# EAGLE design Termocouple (EAGLE 9.3.0)
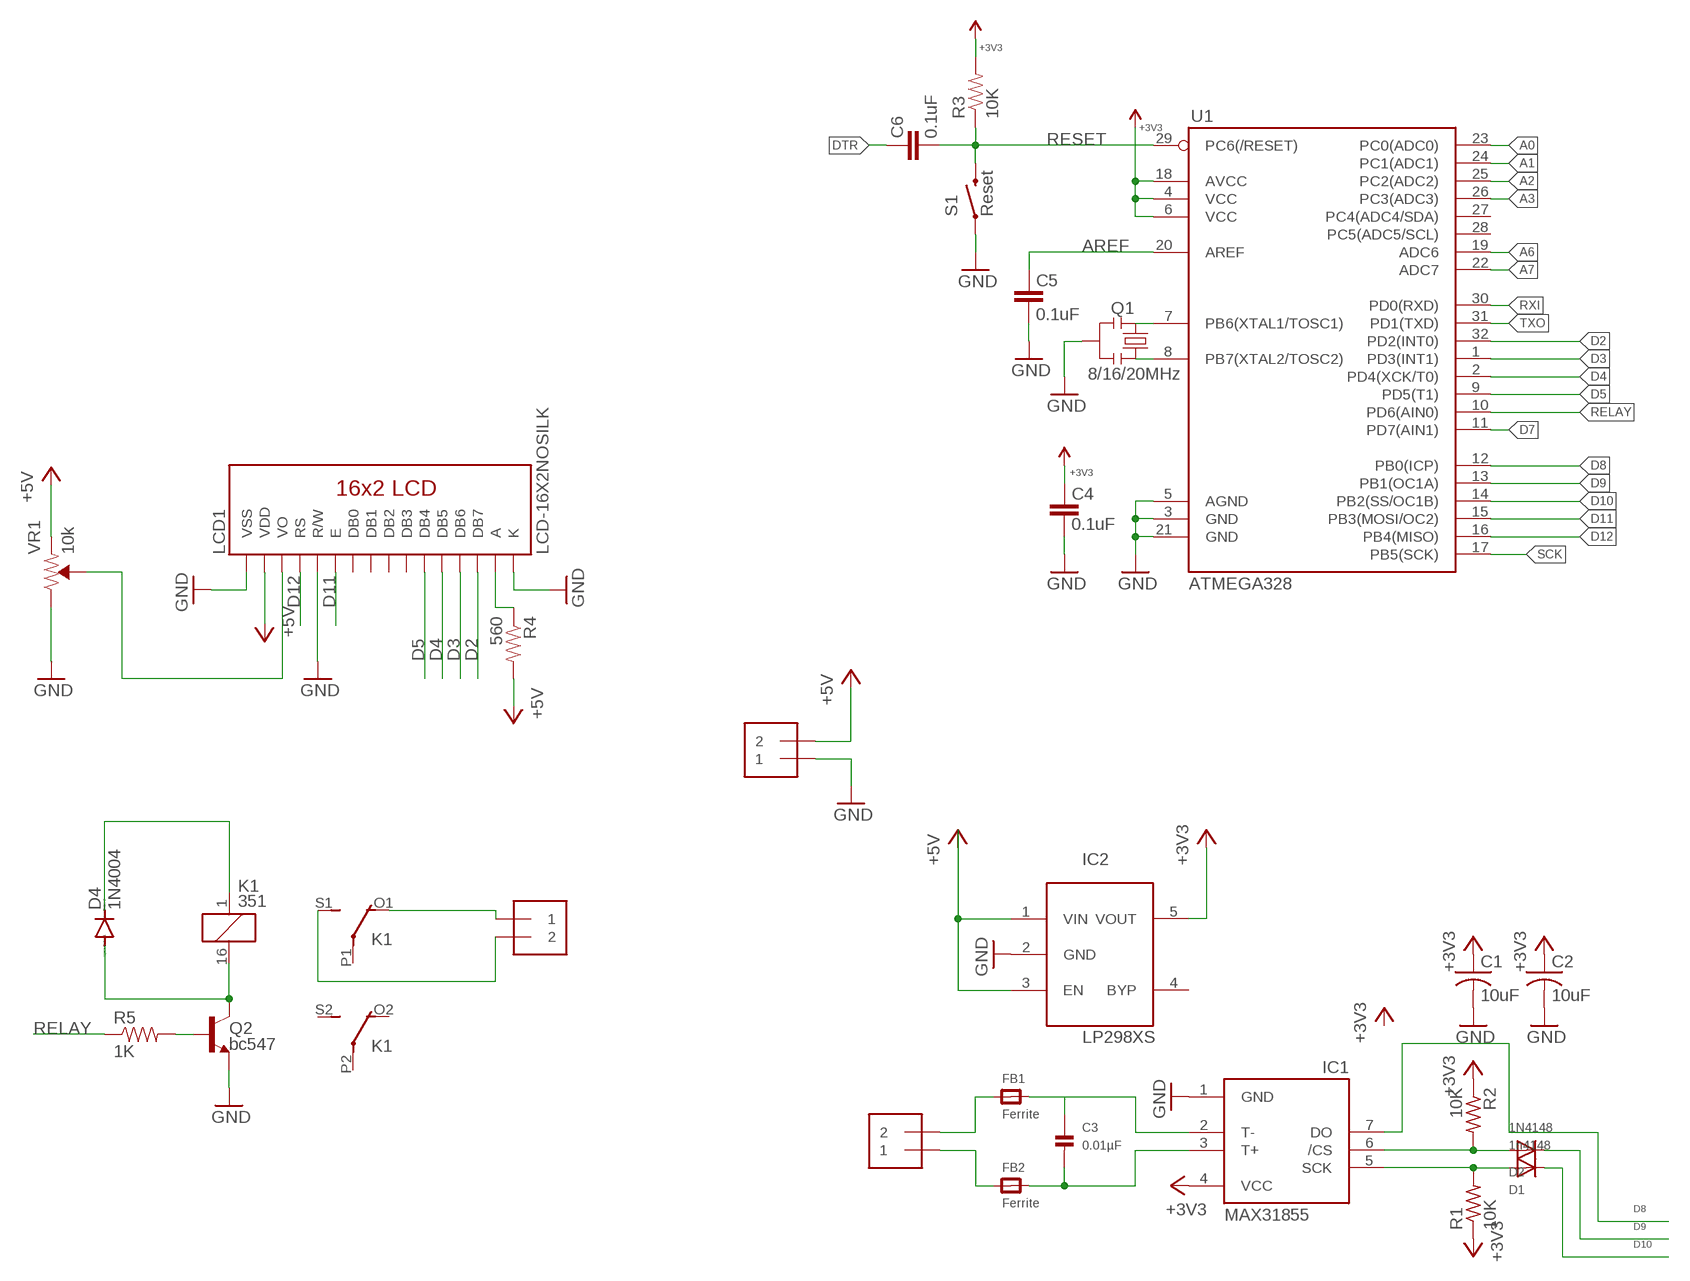
[diagram p0: schematic, sheet 1]

## Parts
C1  10uF  C-USC0805K  [C0805K]
C2  10uF  C-USC0805K  [C0805K]
C3  0.01µF  CAP_CERAMIC_0805  [_0805]
C4  0.1uF  CAP0603-CAP  [0603-CAP]
C5  0.1uF  CAP0603-CAP  [0603-CAP]
C6  0.1uF  CAP0603-CAP  [0603-CAP]
D1  1n4148  DIODESOD-323F  [SOD-323F]
D2  1N4148  DIODESOD-323F  [SOD-323F]
D4  1N4004  [DO41-10]
FB1  Ferrite  FERRITE_0805  [_0805]
FB2  Ferrite  FERRITE_0805  [_0805]
IC1  MAX31855  MAX6675  [SO08]
IC2  LP298XS  [SOT23-5L]
J1  1X2-3.5MM  [1X2-3.5MM]
J2  1X2-3.5MM  [1X2-3.5MM]
J3  1X2-3.5MM  [1X2-3.5MM]
K1  351  [351]
LCD1  LCD-16X2NOSILK  [LCD-16X2_NOSILK]
Q1  8/16/20MHz  RESONATOR1:1  [RESONATOR-SMD-1:1]
Q2  bc547  TRANS_NPN-MMBT2222AL  [SOT23-3]
R1  10K  R-US_R0805  [R0805]
R2  10K  R-US_R0805  [R0805]
R3  10K  RESISTOR0805-RES  [0805]
R4  560  RESISTOR0805-RES  [0805]
R5  1K  RESISTOR0805-RES  [0805]
S1  Reset  SWITCH-MOMENTARY-2SMD-ALT01  [TACTILE-SWITCH-SMD-ALT01]
U1  ATMEGA328  ATMEGA168  [TQFP32-08]
VR1  10k  TRIMPOT-SMD-3MM-CLOSED-1/8W-20%  [TRIMPOT-SMD-3MM-CLOSED]

## Nets
+3V3: C1.1 C2.1 C4.2 IC1.4(VCC) IC2.5(VOUT) R1.1 R2.1 R3.2 U1.4(VCC) U1.6(VCC) U1.18(AVCC) ; supply symbol labelled VCC
+5V: IC2.1(VIN) IC2.3(EN) J2.2 LCD1.2(VDD) R4.2 VR1.1(CCW)
A0: U1.23(PC0(ADC0))
A1: U1.24(PC1(ADC1))
A2: U1.25(PC2(ADC2))
A3: U1.26(PC3(ADC3))
A6: U1.19(ADC6)
A7: U1.22(ADC7)
AREF: C5.2 U1.20(AREF)
CS: D2.A IC1.6(/CS) R2.2
D2: LCD1.14(DB7) U1.32(PD2(INT0))
D3: LCD1.13(DB6) U1.1(PD3(INT1))
D4: LCD1.12(DB5) U1.2(PD4(XCK/T0))
D5: LCD1.11(DB4) U1.9(PD5(T1))
D7: U1.11(PD7(AIN1))
D8: IC1.7(DO) U1.12(PB0(ICP))
D9: D2.C U1.13(PB1(OC1A))
D10: D1.C U1.14(PB2(SS/OC1B))
D11: LCD1.6(E) U1.15(PB3(MOSI/OC2))
D12: LCD1.4(RS) U1.16(PB4(MISO))
DTR: C6.2
GND: C1.2 C2.2 C4.1 C5.1 IC1.1(GND) IC2.2(GND) J2.1 LCD1.1(VSS) LCD1.5(R/W) LCD1.16(K) Q1.2 Q2.2(E) S1.1 S1.2 U1.3(GND) U1.5(AGND) U1.21(GND) VR1.3(CW)
N$1: FB1.1 J1.2
N$2: LCD1.15(A) R4.1
N$3: LCD1.3(VO) VR1.2(WIPER)
N$4: C3.1 FB1.2 IC1.2(T-)
N$5: FB2.1 J1.1
N$6: C3.2 FB2.2 IC1.3(T+)
N$8: Q1.3 U1.8(PB7(XTAL2/TOSC2))
N$9: Q1.1 U1.7(PB6(XTAL1/TOSC1))
N$10: D4.C K1.1
N$11: D4.A K1.16 Q2.3(C)
N$12: Q2.1(B) R5.2
N$13: J3.2 K1.S1(2:S)
N$14: J3.1 K1.O1(2:O)
RELAY: R5.1 U1.10(PD6(AIN0))
RESET: C6.1 R3.1 S1.3 S1.4 U1.29(PC6(/RESET))
RXI: U1.30(PD0(RXD))
SCK: D1.A IC1.5(SCK) R1.2 U1.17(PB5(SCK))
TXO: U1.31(PD1(TXD))
Unconnected: IC2.4(BYP) K1.O2(3:O) K1.P1(2:P) K1.P2(3:P) K1.S2(3:S) LCD1.7(DB0) LCD1.8(DB1) LCD1.9(DB2) LCD1.10(DB3) U1.27(PC4(ADC4/SDA)) U1.28(PC5(ADC5/SCL))

## Library data of the parts
C1 C2 = adafruit:C-US: CAPACITOR, American symbol
C3 = microbuilder:CAP_CERAMIC: Ceramic Capacitors 0402 - 0402 Surface Mount Capacitors 16pF 50V 5% [Digikey: 445-4899-2-ND] 18pF 50V 5% [Digikey: 490-1281-2-ND] 22pF 50V 5% [Digikey: 490-1283-2-ND] 68pF 50V 5% [Digikey: 490-1289-2-ND] 0.1uF 10V 10% [Digikey: 490-1318-2-ND] 1.0uF 6.3V 10% [Digikey: 490-1320-2-ND] 0603 - 0603 Surface Mount Capacitors 16 pF 50V 5% [Digikey: 445-5051-2-ND] 22 pF 50V [Digikey: PCC220ACVTR-ND] 33 pF 50V 5% [Digikey: 490-1415-1-ND] 56pF 50V 5% [Digikey: 490-1421-1-ND] 220pF 50V 5% [Digikey: 445-1285-1-ND] 680 pF 50V 2200 pF 50V 5% C0G [Digikey: 445-1297-1-ND] 5600 pF 100V 5% X7R [Digikey: 478-3711-1-ND] 0.1 µF 25V 10% [Digikey: PCC2277TR-ND] 0.22 µF 16V 10% X7R [Digikey: 445-1318-1-ND] 1.0 µF 25V 10% [Digikey: 445-5146-2-ND] 0603 - RF Specific 3pF 250V +/-0.1pF RF [Digikey: 712-1347-1-ND] 18 pF 250V 5% [Digikey: 478-3505-1-ND or 712-1322-1-ND] 56 pF 250V 5% C0G RF [Digikey: 490-4867-1-ND] 68 pF 250V RF [Digikey: 490-4868-1-ND] 0805 - 0805 Surface Mount Capacitors 220 pF 250V 2% RF Ceramic Capacitor [Digikey: 712-1398-1-ND] 1000 pF 50V 2% NP0 Ceramic Capacitor [Digikey: 478-3760-1-ND] 0.1 µF 25V 10% Ceramic Capacitor [Digikey: PCC1828TR-ND] 1.0 µF 16V 10% Ceramic Capacitor[Digikey: 490-1691-2-ND] 10.0 µF 10V 10% Ceramic Capacitor[Digikey: 709-1228-1-ND] 10.0 uF 16V 10% Ceramic Capacitor [Digikey: 478-5165-2-ND] 47 uF 6.3V 20% Ceramic Capacitor [Digikey: 587-1779-1-ND or 399-5506-1-ND] 1206 - 1206 Surface Mount Capacitors 47uF 10V 20% Ceramic Capacitor [Digikey: 490-5528-1-ND or 399-5508-1-ND or 445-6010-1-ND] 100uF 6.3V -20%, +80% Y5V Ceramic Capacitor (Digikey: 490-4512-1-ND, Mouser: 81-GRM31CF50J107ZE1L)
C4-C6 = SparkFun:CAP: Capacitor Standard 0603 ceramic capacitor, and 0.1" leaded capacitor.
D1 D2 = adafruit:DIODE: Diode SMADIODE - SMA Surface Mount Package 20V 1A Schottky Diode Digikey: 641-1014-6-ND DO-1N4148 - Through Hole Small Current Diode SOD-123 20V 1 A (.5mV Vf) Schottky Diode - Digikey: MBRX120TPMSCT-ND SOD-323 10V 570mA (.38mV Vf, 3ns) Schottky Diode - Digikey: ZLLS410CT-ND SOD-523 30V 30mA Schottky Diode (RB751S-40TE61) - Digikey: RB751S-40TE61CT-ND SOT23-R/W - SOT23 Package (R = Solder Paste/Reflow Ovens, W = Hand-Soldering) BAT54Film 40V 300mA - Digikey: 497-7162-1-ND
D4 = diode:1N4004: DIODE general purpose rectifier, 1 A
FB1 FB2 = microbuilder:FERRITE: Ferrite Bead 0603 MMZ1608B121C - 120 Ohm @ 100MHz, 600mA, 0.15 Ohm DC Resistance - Digikey: 445-2164-1-ND BK1608HW121-T - 120 Ohm, 600mA Ferrite Chip - Digikey: 587-1876-2-ND 0805 HZ0805B272R-10 - 2.7K Ohm @ 100MHz, 200mA, 0.8 Ohm DC Resistance - Digikey: 240-2504-1-ND (see also Murata BLM21BD272SN1L) MMZ2012Y152B - 1.5K Ohm @ 100MHz, 500mA, 0.4 Ohm DC Resistance - Digikey: 445-1560-1-ND - Mainly for high frequency (80-400MHz) MMZ2012R102A - 1K Ohm @ 100MHz, 500mA, 0.3 Ohm DC Resistance - Digikey: 445-1555-2-ND - More general purpose (10-200MHz)
IC1 = adafruit:MAX6675
IC2 = adafruit:LP298X
J1-J3 = adafruit:1X2: 3.5mm Terminal block http://www.ladyada.net/library/pcb/eaglelibrary.html
K1 = relay:351: RELAY 2 x switch, Omron; OC_FARNELL: unknown; OC_NEWARK: unknown
LCD1 = SparkFun-Displays:LCD-16X2: Standard text-only 16x2 parallel input LCD Basic 16 character by 2 line display. Typically utilizes the extremely common HD44780 parallel interface chipset SparkFun Products: Basic 16x2 Green <https://www.sparkfun.com/products/255> Basic 8x2 Green <https://www.sparkfun.com/products/11122>; SF_ID: LCD-00255
Q1 = Testing:RESONATOR: Resonator Small SMD resonator. This is the itty bitty 10/20MHz resonators with built in caps. CSTCE10M0G55 and CSTCE20M0V53. Footprint for SMD has been used in SFE production for years, and does work okay. 1:1 is an attempt to get larger fillets on the sides so it will be easier to inspect these solders in our AOI machine. The pads have been minimized to match the actual metal under the resonator. To see this relation, it includes an image import of the bottom side of the component. Imported to scale on layer 200.
Q2 = SparkFun-DiscreteSemi:TRANS_NPN: NPN transistor Current controlled devices typically used to amplify current or used as a switch. BC547 - COM-08928 <http://www.sparkfun.com/products/8928> (TO-92 45V 100mA) (1.Collector 2.Base 3.Emitter) 2N3904 - COM-00521 <http://www.sparkfun.com/products/521> (TO-92 40V 200mA) (1.Emitter 2.Base 3.Collector) P2N2222A - COM-12852 <http://www.sparkfun.com/products/12852> (TO-92 40V 600mA) (1.Collector 2.Base 3.Emitter); PROD_ID: TRANS-08049; VALUE: 600mA/40V
R1 R2 = adafruit:R-US_: RESISTOR, American symbol
R3-R5 = SparkFun:RESISTOR: Resistor Basic schematic elements and footprints for 0603, 1206, and PTH resistors.
S1 = Testing:SWITCH-MOMENTARY-2: Various NO switches- pushbuttons, reed, etc
U1 = SparkFun:ATMEGA168
VR1 = SparkFun-Resistors:TRIMPOT: Trimming Potentiometer (Trimpot) Three-terminal potentiometers, with an adjustable wiper and two adjustable resistors. A pot can be used to create a configurable voltage divider, or as a variable resistor. "Trimpots" are a subset of potentiometers, usually intended for "set-and-forget" applications. They're often more delicate than standard potentiometers - rated for fewer turns. Variants PTH-KNOB - PTH Trimpot w/ finger-adjustable knob Trimpot 10K with Knob <https://www.sparkfun.com/products/9806> (COM-09806) Datasheet <http://www.sparkfun.com/datasheets/Components/General/TSR-3386.pdf> SMD-3MM-CLOSED-FRAME - SMD 3mm Square Closed-Frame Trimpot Used on e.g. EasyDriver - Stepper Motor Driver <https://www.sparkfun.com/products/12779> Datasheet <http://www.bitechnologies.com/pdfs/22.pdf> (22AR10KTR) SMD-5MM - SMD 5mm Square Closed-Frame Trimpot Used on e.g. IOIO-OTG - V2.2 <https://www.sparkfun.com/products/13613> Datasheet <http://www.vishay.com/docs/51008/ts53.pdf> (TS53YL502MR10) SMD-3MM-1/10W-25% - 3mm Square Open-Frame Trimpot Used on e.g. SparkFun Shapeoko <https://www.sparkfun.com/products/13899> Datasheet <http://www.bourns.com/docs/Product-Datasheets/TC33.pdf> (TC33X-2-103E); PROD_ID: RES-09285

## Net classes
1 vcc: width 0.254 mm

## Board
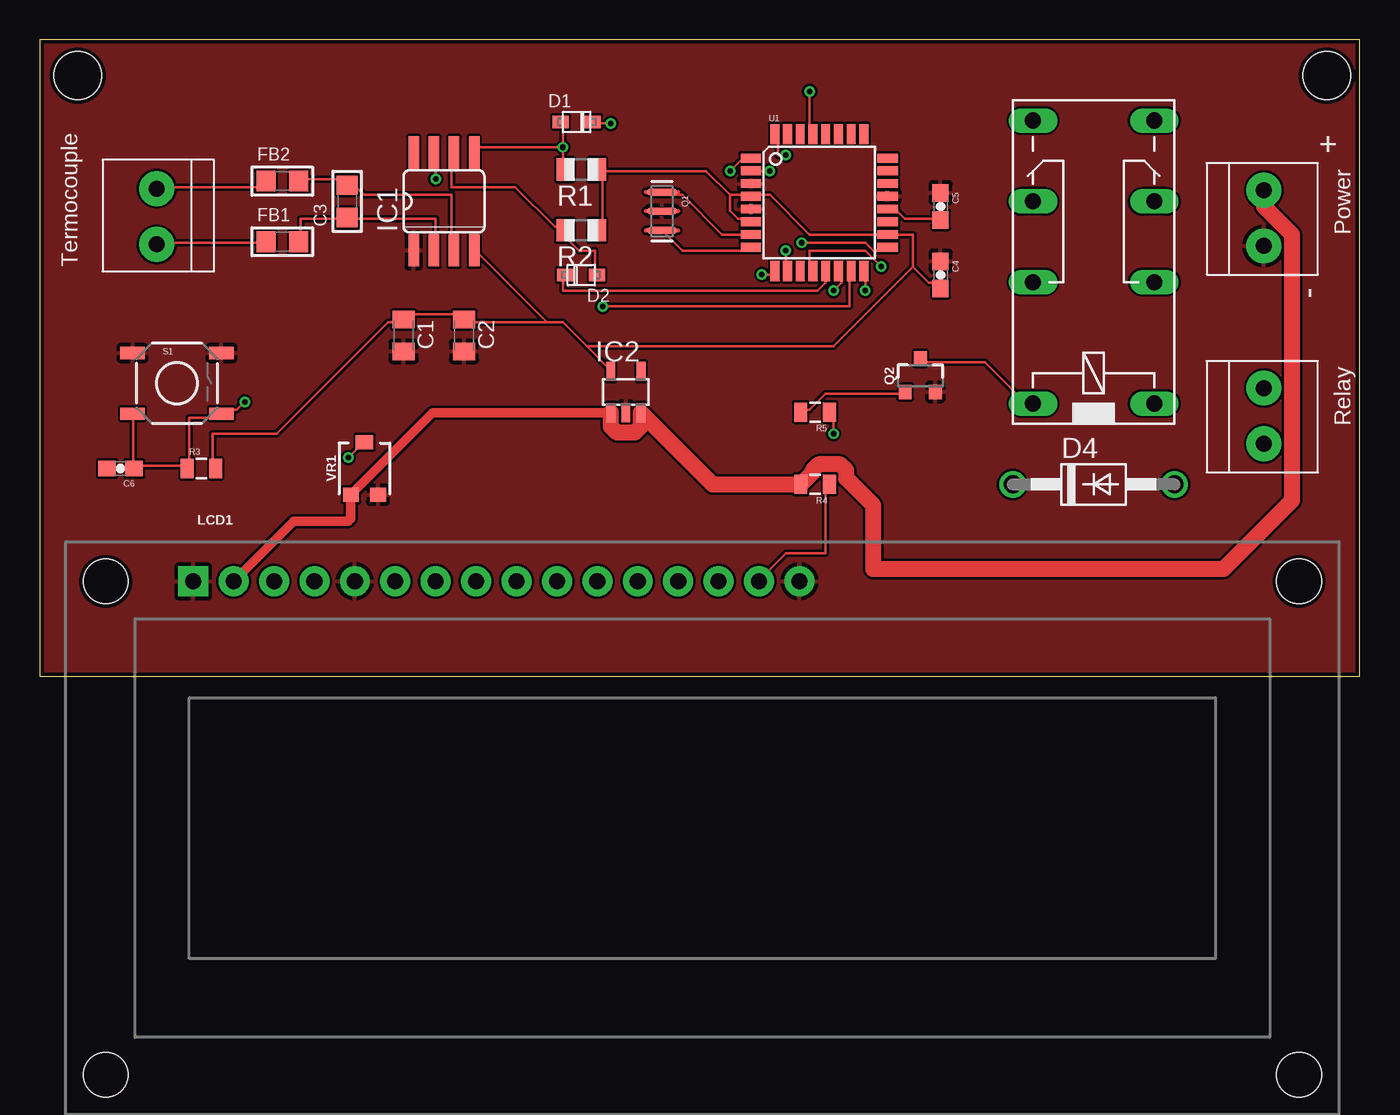
[diagram p1: board, top side]
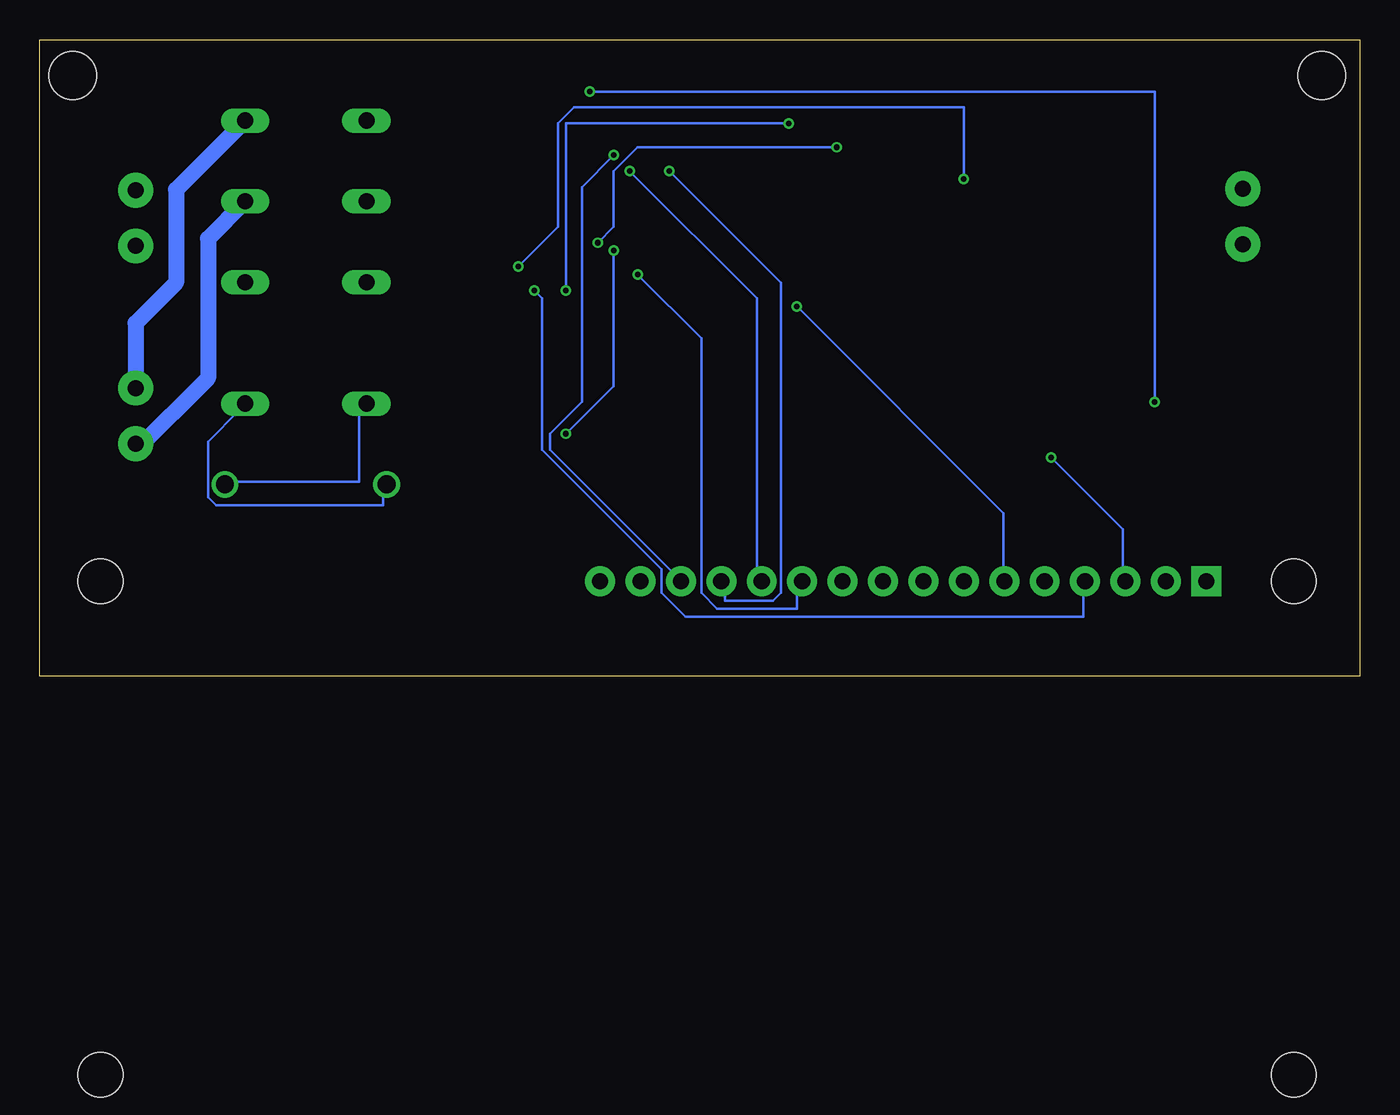
[diagram p2: board, bottom side, seen from below]

Size 82.95 x 39.98 mm. Coordinates in mm from the lower left corner, seen from the top.
Outline: 0,0 82.95,0 82.95,39.98 0,39.98 0,0
Copper layers (1*16): Top 0.035mm / dielectric 1.5mm / Bottom 0.035mm
Design rules "SeeedStudio_2layer_DRU_no_angle_20140221": minimum track width 6mil, minimum drill 12mil, track to track 6mil, track to pad 6mil, pad to pad 6mil, via to via 6mil, smd to smd 0mil, copper to edge 10mil, drill to drill 10mil, minimum pad ring 10mil, minimum via ring 6mil, stop-mask expansion 2mil, vias tented up to drill 100mil, thermal gap 10mil
Holes 3 mm at 2.38,37.73 80.88,37.73

### Footprints (pad centres in the part's own frame; a part is rotated, then mirrored left to right if it is on the bottom)
C0805K = smd 1.1 x 1.4: 1 -1,0; 2 1,0
_0805 = smd 1.2 x 1.3: 1 -1.016,0; 2 1.016,0
0603-CAP = smd 1.1 x 1: 1 -0.85,0; 2 0.85,0
SOD-323F = smd 1 x 0.8: A -1,0; C 1,0
DO41-10 = drill 1.118: A 5.08,0; C -5.08,0
SO08 = smd 0.66 x 2.032: 1 -1.905,-3.073; 2 -0.635,-3.073; 3 0.635,-3.073; 4 1.905,-3.073; 5 1.905,3.073; 6 0.635,3.073; 7 -0.635,3.073; 8 -1.905,3.073
SOT23-5L = smd 0.55 x 1.2: 1 -0.95,-1.3; 2 0,-1.3; 3 0.95,-1.3; 4 0.95,1.3; 5 -0.95,1.3
1X2-3.5MM = drill 1 pad 2.184: 1 1.8,0; 2 -1.7,0
351 = drill 1.016 long: 1 -3.81,-3.81; 16 -3.81,3.81; O1 8.89,-3.81; O2 8.89,3.81; P1 3.81,-3.81; P2 3.81,3.81; S1 13.97,-3.81; S2 13.97,3.81
LCD-16X2_NOSILK = drill 1.016 pad 1.88 square: 1 -32,15.5 | drill 1.016 pad 1.88: 2 -29.46,15.5; 3 -26.92,15.5; 4 -24.38,15.5; 5 -21.84,15.5; 6 -19.3,15.5; 7 -16.76,15.5; 8 -14.22,15.5; 9 -11.68,15.5; 10 -9.14,15.5; 11 -6.6,15.5; 12 -4.06,15.5; 13 -1.52,15.5; 14 1.02,15.5; 15 3.56,15.5; 16 6.1,15.5 | hole 2.8: -37.5,15.5; -37.5,-15.5; 37.5,15.5; 37.5,-15.5
RESONATOR-SMD-1:1 = smd 0.45 x 1.905: 1 -1.2,0; 2 0,0; 3 1.2,0
SOT23-3 = smd 0.8 x 0.9: 1 -0.95,-1; 2 0.95,-1; 3 0,1.1
R0805 = smd 1.1 x 1.4: 1 -1,0; 2 1,0
0805 = smd 0.8 x 1.2: 1 -0.9,0; 2 0.9,0
TACTILE-SWITCH-SMD-ALT01 = smd 1.524 x 0.762: 1 -2.794,1.905; 2 2.794,1.905; 3 -2.794,-1.905; 4 2.794,-1.905
TQFP32-08 = smd 1.27 x 0.559: 1 -4.293,2.8; 2 -4.293,2; 3 -4.293,1.2; 4 -4.293,0.4; 5 -4.293,-0.4; 6 -4.293,-1.2; 7 -4.293,-2; 8 -4.293,-2.8; 17 4.293,-2.8; 18 4.293,-2; 19 4.293,-1.2; 20 4.293,-0.4; 21 4.293,0.4; 22 4.293,1.2; 23 4.293,2; 24 4.293,2.8 | smd 0.559 x 1.27: 9 -2.8,-4.293; 10 -2,-4.293; 11 -1.2,-4.293; 12 -0.4,-4.293; 13 0.4,-4.293; 14 1.2,-4.293; 15 2,-4.293; 16 2.8,-4.293; 25 2.8,4.293; 26 2,4.293; 27 1.2,4.293; 28 0.4,4.293; 29 -0.4,4.293; 30 -1.2,4.293; 31 -2,4.293; 32 -2.8,4.293
TRIMPOT-SMD-3MM-CLOSED = smd 1 x 0.9: 1 -0.85,-1.65; 3 0.85,-1.65 | smd 1.1 x 0.9: 2 0,1.65

### Placement (x,y rotation side)
C1  22.86,21.4 270 top
C2  26.67,21.4 270 top
C3  19.32,29.83 90 top
C4  56.61,25.21 270 top
C5  56.61,29.52 270 top
C6  5.08,13.05 180 top
D1  33.74,34.82 0 top
D2  34.02,25.21 180 top
D4  66.23,12.05 0 top
FB1  15.24,27.29 0 top
FB2  15.24,31.1 0 top
IC1  25.4,29.83 0 top
IC2  36.83,17.86 0 top
J1  7.35,28.83 90 top
J2  76.93,28.83 270 top
J3  76.93,16.4 270 top
K1  66.23,20.94 90 top
LCD1  41.64,-9.54 0 top
Q1  39.1,29.21 270 top
Q2  55.34,18.86 0 top
R1  34.02,31.83 180 top
R2  34.02,28.02 180 top
R3  10.16,13.05 0 top
R4  48.72,12.05 180 top
R5  48.72,16.59 180 top
S1  8.62,18.4 0 top
U1  48.99,29.75 0 top
VR1  20.4,13.05 0 top

### Tracks (layer width: path | path; a pad name or v marks a point on that pad's centre or on a via)
+3V3
  Top 0.152: 54.88,25.73 55.88,24.73 56.38,24.73 C4.2 | 54.88,25.73 54.88,27.73 53.38,27.73 U1.18 52.88,27.73 48.38,27.73 45.88,30.23 44.88,30.23 U1.4 44.38,30.23 43.38,30.23 | 43.38,30.23 43.38,29.23 43.88,28.73 44.38,28.73 U1.6 | 35.38,31.73 35.38,28.23 R2.1 | 43.38,30.23 41.88,31.73 35.38,31.73 | 35.38,31.73 R1.1 | 34.38,20.73 32.88,22.23 31.88,22.23 | 34.38,20.73 35.88,19.23 IC2.5 | 31.88,22.23 26.88,22.23 C2.1 26.38,22.73 22.88,22.73 C1.1 22.38,22.23 21.88,22.23 14.88,15.23 10.88,15.23 10.88,13.23 R3.2 | 31.88,22.23 27.38,26.73 IC1.4 | 54.88,25.73 49.88,20.73 34.38,20.73
+5V
  Top 0.61: LCD1.2 15.95,9.73 19.38,9.73 19.55,9.9 VR1.1 24.7,16.55 35.9,16.55
  Top 1.016: J2.2 76.93,29.51 78.68,27.76 78.68,11.03 74.38,6.73 52.38,6.73 52.38,10.73 50.68,12.43 50.68,12.92 50.29,13.31 48.95,13.31 48.56,12.92 48.56,12.79 R4.2 42.29,12.05 IC2.3 37.77,16.55 37.77,15.69 37.38,15.3 36.28,15.3 35.9,15.69 35.9,16.55 IC2.1
AREF
  Top 0.152: C5.2 56.38,28.73 54.38,28.73 53.88,29.23 53.38,29.23 U1.20
CS
  Top 0.152: D2.A 34.88,25.23 34.88,26.73 33.88,26.73 32.88,27.73 R2.2 32.88,28.23 32.38,28.23 29.88,30.73 25.88,30.73 25.88,32.73 IC1.6
D2  (via drill 0.35)
  Top 0.152: v46.88,32.73 46.38,32.73 46.38,33.73 U1.32
  Bottom 0.152: v46.88,32.73 48.88,30.73 48.88,17.23 50.88,15.23 50.88,14.23 42.88,6.23 LCD1.14
D3  (via drill 0.35)
  Top 0.152: v43.38,31.73 44.38,32.73 U1.1
  Bottom 0.152: v43.38,31.73 36.38,24.73 36.38,5.23 36.88,4.73 39.88,4.73 39.88,5.73 LCD1.13
D4  (via drill 0.35)
  Top 0.152: v45.88,31.73 44.88,31.73 U1.2
  Bottom 0.152: v45.88,31.73 37.88,23.73 37.88,6.23 LCD1.12
D5  (via drill 0.35)
  Top 0.152: v45.38,25.23 46.38,25.23 U1.9
  Bottom 0.152: v45.38,25.23 41.38,21.23 41.38,5.23 40.38,4.23 35.38,4.23 35.38,5.73 LCD1.11
D8  (via drill 0.35)
  Top 0.152: v52.88,25.73 51.88,26.73 48.38,26.73 48.38,25.73 U1.12 | v24.88,31.23 24.88,32.73 IC1.7
  Bottom 0.152: v52.88,25.73 50.38,28.23 50.38,34.73 49.38,35.73 24.88,35.73 v24.88,31.23
D9
  Top 0.152: D2.C 32.88,25.23 32.88,24.23 48.88,24.23 49.38,24.73 49.38,25.23 U1.13
D10  (via drill 0.35)
  Top 0.152: v35.88,34.73 34.88,34.73 D1.C | v49.88,24.23 50.38,24.73 50.38,25.23 U1.14
  Bottom 0.152: v35.88,34.73 49.88,34.73 v49.88,24.23
D11  (via drill 0.35)
  Top 0.152: v35.38,23.23 50.88,23.23 50.88,25.23 U1.15
  Bottom 0.152: v35.38,23.23 22.38,10.23 22.38,6.23 LCD1.6
D12  (via drill 0.35)
  Top 0.152: v51.88,24.23 51.88,25.23 U1.16
  Bottom 0.152: v51.88,24.23 51.38,23.73 51.38,14.23 43.88,6.73 43.88,5.23 42.38,3.73 17.38,3.73 17.38,5.73 LCD1.4
GND
  pour Top: -0.62,40.73 84.38,40.73 84.38,-1.27 -0.62,-1.27
N$1
  Top 0.152: FB1.1 13.88,27.23 7.38,27.23 J1.2
N$2
  Top 0.152: R4.1 49.38,11.73 49.38,7.73 46.88,7.73 45.38,6.23 LCD1.15
N$3  (via drill 0.35)
  Top 0.152: v19.38,13.73 20.38,14.73 VR1.2
  Bottom 0.152: v19.38,13.73 14.88,9.23 14.88,6.23 LCD1.3
N$4
  Top 0.152: FB1.2 16.38,27.73 16.38,28.73 18.88,28.73 C3.1 19.38,28.73 24.88,28.73 24.88,27.23 IC1.2
N$5
  Top 0.152: FB2.1 13.88,30.73 7.38,30.73 J1.1
N$6
  Top 0.152: FB2.2 16.38,31.23 18.88,31.23 C3.2 19.38,30.73 19.88,30.73 20.38,30.23 25.88,30.23 25.88,27.23 IC1.3
N$8
  Top 0.152: Q1.3 40.38,26.73 44.38,26.73 U1.8
N$9
  Top 0.152: U1.7 44.38,27.73 42.88,27.73 40.38,30.23 39.38,30.23 Q1.1
N$10
  Bottom 0.152: K1.1 70.38,16.73 72.38,14.73 72.38,11.23 71.88,10.73 61.38,10.73 61.38,11.73 D4.C
N$11
  Top 0.152: Q2.3 55.38,19.73 59.38,19.73 61.88,17.23 62.38,17.23 K1.16
  Bottom 0.152: D4.A 70.88,12.23 62.88,12.23 62.88,16.73 K1.16
N$12
  Top 0.152: Q2.1 54.38,17.73 49.38,17.73 48.38,16.73 47.88,16.73 R5.2
N$13
  Bottom 1.016: K1.S1 74.38,30.57 74.38,24.73 76.93,22.18 J3.2
N$14
  Bottom 1.016: K1.O1 72.38,27.49 72.38,18.73 76.93,14.18 J3.1
RELAY  (via drill 0.35)
  Top 0.152: v49.88,15.23 49.88,16.23 R5.1 | v46.88,26.73 46.88,25.73 U1.10
  Bottom 0.152: v49.88,15.23 46.88,18.23 v46.88,26.73
RESET  (via drill 0.35)
  Top 0.152: S1.3 5.88,16.23 5.88,13.23 C6.1 6.38,13.23 8.88,13.23 R3.1 9.38,13.23 9.38,16.23 11.38,16.23 S1.4 11.88,16.73 12.38,16.73 v12.88,17.23 | v48.38,36.73 48.38,34.23 U1.29
  Bottom 0.152: v48.38,36.73 12.88,36.73 v12.88,17.23
SCK  (via drill 0.35)
  Top 0.152: v32.88,33.23 32.88,32.23 R1.2 | v32.88,33.23 32.88,34.73 D1.A | v47.88,27.23 51.88,27.23 52.38,26.73 52.88,26.73 U1.17 | v32.88,33.23 27.38,33.23 IC1.5
  Bottom 0.152: v47.88,27.23 46.88,28.23 46.88,31.73 45.38,33.23 v32.88,33.23

### Text on the board
tNames: + | Power | Termocouple | - | Relay